# EAGLE design DL40 (EAGLE 6.2)
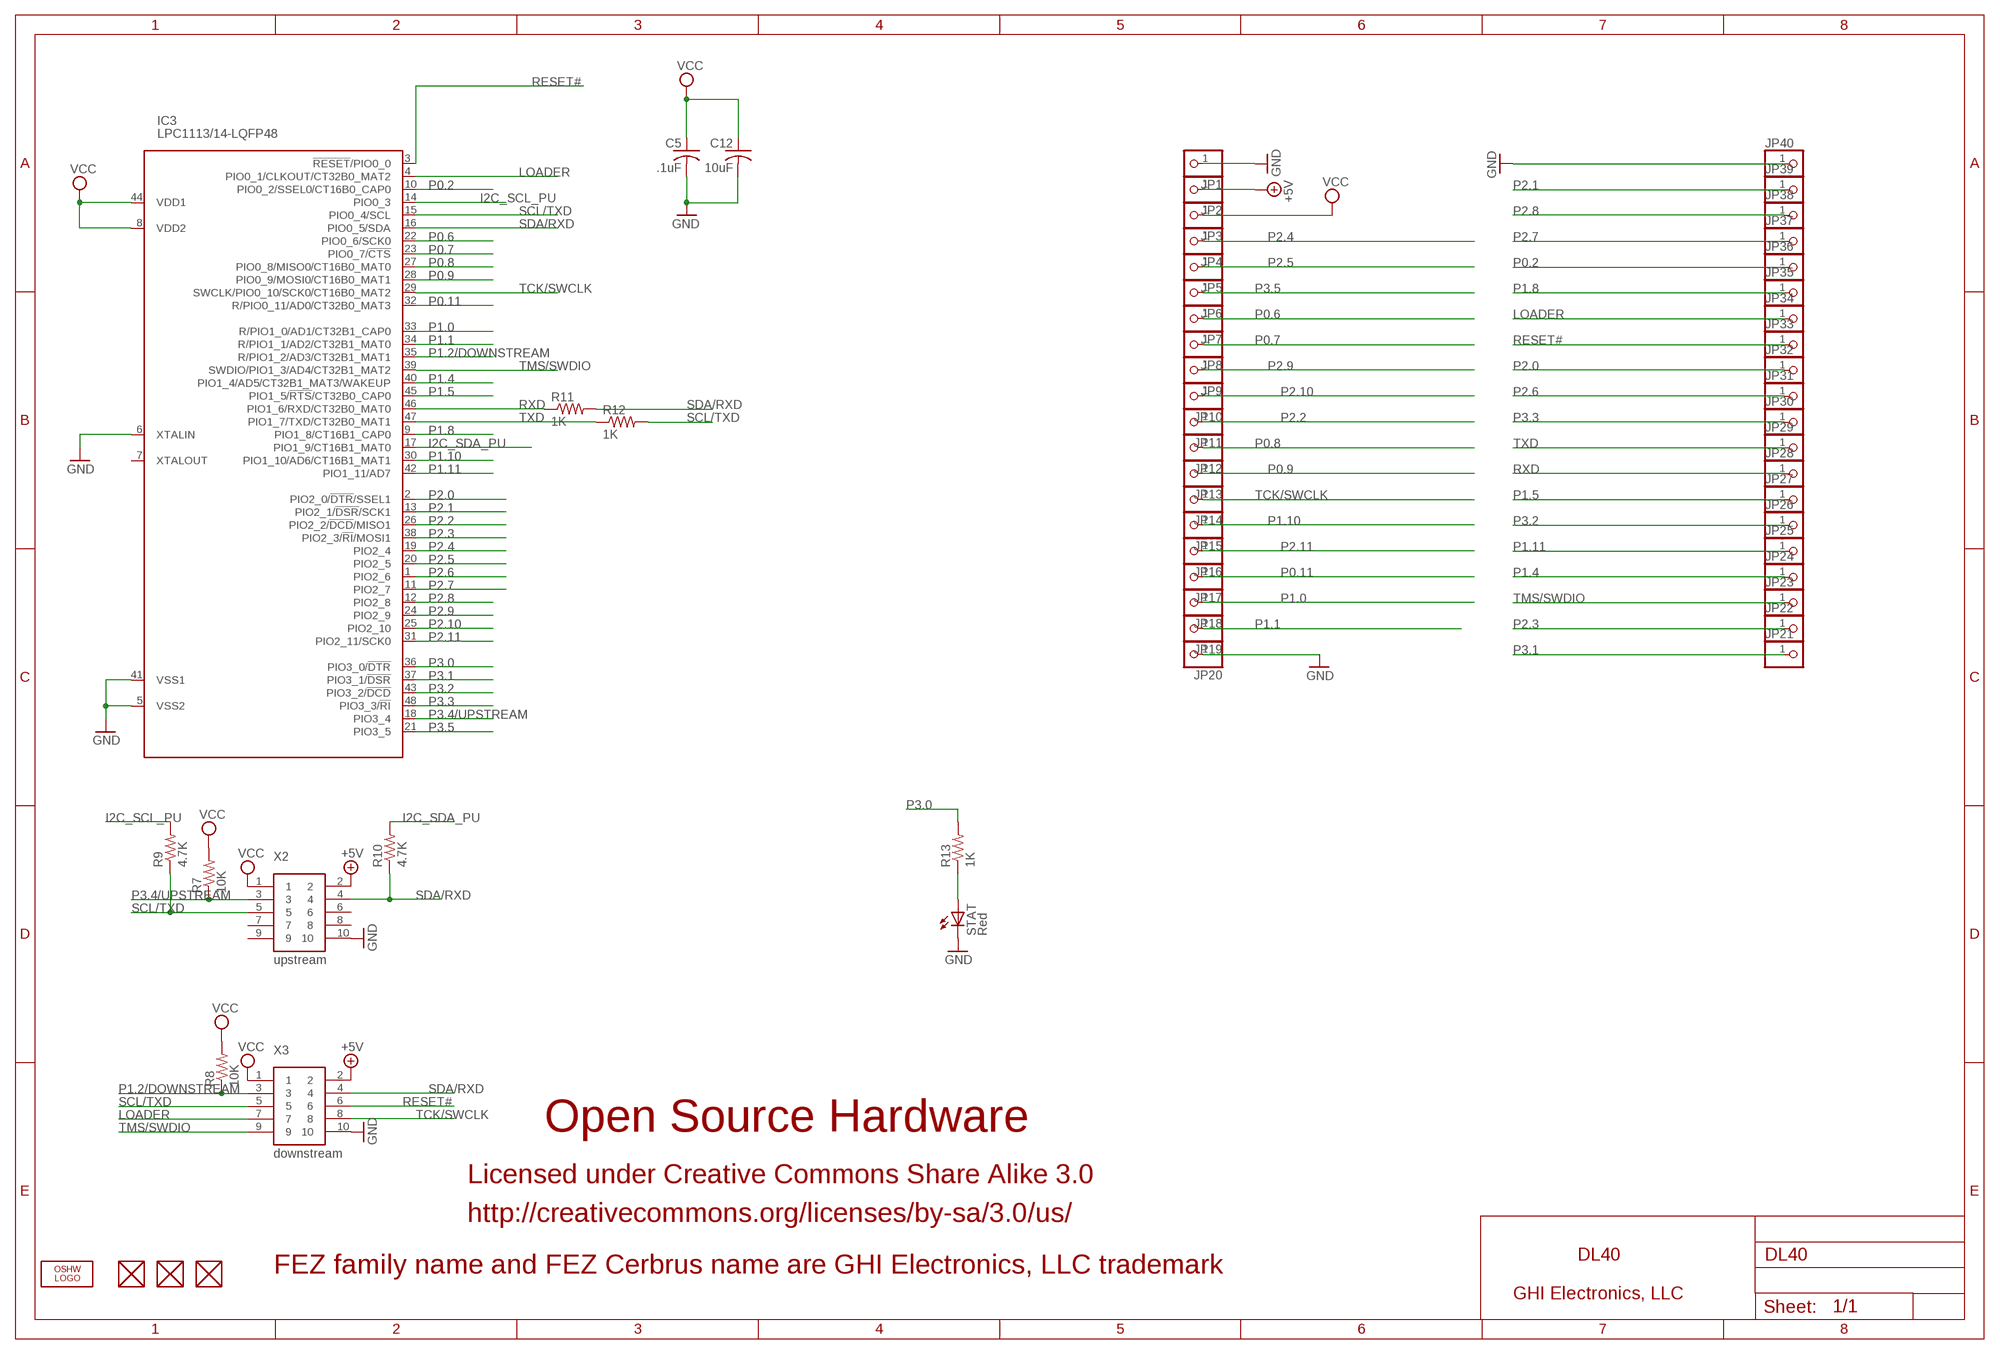
[diagram p0: schematic, sheet 1]

## Parts
C5  .1uF  C-USC0603K  [C0603K]
C12  10uF  C-USC0805K  [C0805K]
FUD4  FIDUCIAL  [FIDUCIAL_40MIL]
FUD5  FIDUCIAL  [FIDUCIAL_40MIL]
FUD6  FIDUCIAL  [FIDUCIAL_40MIL]
IC3  LPC1113/14-LQFP48  [LQFP48]
JP1  PINHD-1X1  [1X01]
JP2  PINHD-1X1  [1X01]
JP3  PINHD-1X1  [1X01]
JP4  PINHD-1X1  [1X01]
JP5  PINHD-1X1  [1X01]
JP6  PINHD-1X1  [1X01]
JP7  PINHD-1X1  [1X01]
JP8  PINHD-1X1  [1X01]
JP9  PINHD-1X1  [1X01]
JP10  PINHD-1X1  [1X01]
JP11  PINHD-1X1  [1X01]
JP12  PINHD-1X1  [1X01]
JP13  PINHD-1X1  [1X01]
JP14  PINHD-1X1  [1X01]
JP15  PINHD-1X1  [1X01]
JP16  PINHD-1X1  [1X01]
JP17  PINHD-1X1  [1X01]
JP18  PINHD-1X1  [1X01]
JP19  PINHD-1X1  [1X01]
JP20  PINHD-1X1  [1X01]
JP21  PINHD-1X1  [1X01]
JP22  PINHD-1X1  [1X01]
JP23  PINHD-1X1  [1X01]
JP24  PINHD-1X1  [1X01]
JP25  PINHD-1X1  [1X01]
JP26  PINHD-1X1  [1X01]
JP27  PINHD-1X1  [1X01]
JP28  PINHD-1X1  [1X01]
JP29  PINHD-1X1  [1X01]
JP30  PINHD-1X1  [1X01]
JP31  PINHD-1X1  [1X01]
JP32  PINHD-1X1  [1X01]
JP33  PINHD-1X1  [1X01]
JP34  PINHD-1X1  [1X01]
JP35  PINHD-1X1  [1X01]
JP36  PINHD-1X1  [1X01]
JP37  PINHD-1X1  [1X01]
JP38  PINHD-1X1  [1X01]
JP39  PINHD-1X1  [1X01]
JP40  PINHD-1X1  [1X01]
LOGO2  LOGO-OSHW-FILLX0200-NT  [OSHW_FILLX200_NOTEXT]
R7  10K  R-US_R0603  [R0603]
R8  10K  R-US_R0603  [R0603]
R9  4.7K  R-US_R0603  [R0603]
R10  4.7K  R-US_R0603  [R0603]
R11  1K  R-US_R0603  [R0603]
R12  1K  R-US_R0603  [R0603]
R13  1K  R-US_R0603  [R0603]
STAT  Red  LEDCHIPLED_0805  [CHIPLED_0805]
X2  upstream  2X5_1.27MM  [2X5_1.27MM]
X3  downstream  2X5_1.27MM  [2X5_1.27MM]

## Nets
+5V: JP2.1 X2.2 X3.2
GND [power]: C5.2 C12.2 IC3.5(VSS2) IC3.6(XTALIN) IC3.41(VSS1) JP1.1 JP20.1 JP40.1 STAT.C X2.10 X3.10
I2C_SCL_PU: IC3.14(PIO0_3) R9.2
I2C_SDA_PU: IC3.17(PIO1_9/CT16B1_MAT0) R10.2
LOADER: IC3.4(PIO0_1/CLKOUT/CT32B0_MAT2) JP34.1 X3.7
N$10: R13.1 STAT.A
P0.2: IC3.10(PIO0_2/SSEL0/CT16B0_CAP0) JP36.1
P0.6: IC3.22(PIO0_6/SCK0) JP7.1
P0.7: IC3.23(PIO0_7/!CTS!) JP8.1
P0.8: IC3.27(PIO0_8/MISO0/CT16B0_MAT0) JP12.1
P0.9: IC3.28(PIO0_9/MOSI0/CT16B0_MAT1) JP13.1
P0.11: IC3.32(R/PIO0_11/AD0/CT32B0_MAT3) JP17.1
P1.0: IC3.33(R/PIO1_0/AD1/CT32B1_CAP0) JP18.1
P1.1: IC3.34(R/PIO1_1/AD2/CT32B1_MAT0) JP19.1
P1.2/DOWNSTREAM: IC3.35(R/PIO1_2/AD3/CT32B1_MAT1) R8.1 X3.3
P1.4: IC3.40(PIO1_4/AD5/CT32B1_MAT3/WAKEUP) JP24.1
P1.5: IC3.45(PIO1_5/!RTS!/CT32B0_CAP0) JP27.1
P1.8: IC3.9(PIO1_8/CT16B1_CAP0) JP35.1
P1.10: IC3.30(PIO1_10/AD6/CT16B1_MAT1) JP15.1
P1.11: IC3.42(PIO1_11/AD7) JP25.1
P2.0: IC3.2(PIO2_0/!DTR!/SSEL1) JP32.1
P2.1: IC3.13(PIO2_1/!DSR!/SCK1) JP39.1
P2.2: IC3.26(PIO2_2/!DCD!/MISO1) JP11.1
P2.3: IC3.38(PIO2_3/!RI!/MOSI1) JP22.1
P2.4: IC3.19(PIO2_4) JP4.1
P2.5: IC3.20(PIO2_5) JP5.1
P2.6: IC3.1(PIO2_6) JP31.1
P2.7: IC3.11(PIO2_7) JP37.1
P2.8: IC3.12(PIO2_8) JP38.1
P2.9: IC3.24(PIO2_9) JP9.1
P2.10: IC3.25(PIO2_10) JP10.1
P2.11: IC3.31(PIO2_11/SCK0) JP16.1
P3.0: IC3.36(PIO3_0/!DTR!) R13.2
P3.1: IC3.37(PIO3_1/!DSR!) JP21.1
P3.2: IC3.43(PIO3_2/!DCD!) JP26.1
P3.3: IC3.48(PIO3_3/!RI!) JP30.1
P3.4/UPSTREAM: IC3.18(PIO3_4) R7.1 X2.3
P3.5: IC3.21(PIO3_5) JP6.1
RESET#: IC3.3(!RESET!/PIO0_0) JP33.1 X3.6
RXD: IC3.46(PIO1_6/RXD/CT32B0_MAT0) JP28.1 R11.1
SCL/TXD: IC3.15(PIO0_4/SCL) R9.1 R12.2 X2.5 X3.5
SDA/RXD: IC3.16(PIO0_5/SDA) R10.1 R11.2 X2.4 X3.4
TCK/SWCLK: IC3.29(SWCLK/PIO0_10/SCK0/CT16B0_MAT2) JP14.1 X3.8
TMS/SWDIO: IC3.39(SWDIO/PIO1_3/AD4/CT32B1_MAT2) JP23.1 X3.9
TXD: IC3.47(PIO1_7/TXD/CT32B0_MAT1) JP29.1 R12.1
VCC [power]: C5.1 C12.1 IC3.8(VDD2) IC3.44(VDD1) JP3.1 R7.2 R8.2 X2.1 X3.1
Unconnected: FUD4.P$1 FUD5.P$1 FUD6.P$1 IC3.7(XTALOUT) X2.6 X2.7 X2.8 X2.9

## Notes on the sheet
- Open Source Hardware
- Licensed under Creative Commons Share Alike 3.0
- http://creativecommons.org/licenses/by-sa/3.0/us/
- DL40
- FEZ family name and FEZ Cerbrus name are GHI Electronics, LLC trademark
- GHI Electronics, LLC

## Library data of the parts
C5 C12 = rcl:C-US: CAPACITOR, American symbol
FUD4-FUD6 = GHI:FIDUCIAL
IC3 = lpc1100v1.1:LPC1113/14-LQFP48: NXP Semiconductors LPC11xx microcontrollers <http://ics.nxp.com/products/lpc1000/lpc11xx/> ARM 32-bit Cortex-M0 Microcontroller with MPU CPU clock up to 50MHz Up to 32KByte on-chip Flash ROM with In-System Programming (ISP) and In-Application Programming (IAP) via On-Chip Bootloader Up to 8KByte SRAM Nested Vectored Interrupt Controller Up to 2 SPI controllers UART with full Modem Interface and RS485 Support Fast Mode I2C-Bus 4 Timers with 4 capture channels and 13 output channels Watchdog (WDT) Sytem tick timer 10-bit ADC with 8 channels Power Management Unit (PMU) Brownout detection 12MHz internal RC oscillator Serial Wire Debug/Trace port
JP1-JP40 = pinhead:PINHD-1X1: PIN HEADER
LOGO2 = Logo:LOGO-OSHW-FILL
R7-R13 = rcl:R-US_: RESISTOR, American symbol
STAT = led:LED: LED OSRAM: - CHIPLED LG R971, LG N971, LY N971, LG Q971, LY Q971, LO R971, LY R971 LH N974, LH R974 LS Q976, LO Q976, LY Q976 LO Q996 - Hyper CHIPLED LW Q18S LB Q993, LB Q99A, LB R99A - SideLED LS A670, LO A670, LY A670, LG A670, LP A670 LB A673, LV A673, LT A673, LW A673 LH A674 LY A675 LS A676, LA A676, LO A676, LY A676, LW A676 LS A679, LY A679, LG A679 - Hyper Micro SIDELED® LS Y876, LA Y876, LO Y876, LY Y876 LT Y87S - SmartLED LW L88C, LW L88S LB L89C, LB L89S, LG L890 LS L89K, LO L89K, LY L89K LS L896, LA L896, LO L896, LY L896 - TOPLED LS T670, LO T670, LY T670, LG T670, LP T670 LSG T670, LSP T670, LSY T670, LOP T670, LYG T670 LG T671, LOG T671, LSG T671 LB T673, LV T673, LT T673, LW T673 LH T674 LS T676, LA T676, LO T676, LY T676, LB T676, LH T676, LSB T676, LW T676 LB T67C, LV T67C, LT T67C, LS T67K, LO T67K, LY T67K, LW E67C LS E67B, LA E67B, LO E67B, LY E67B, LB E67C, LV E67C, LT E67C LW T67C LS T679, LY T679, LG T679 LS T770, LO T770, LY T770, LG T770, LP T770 LB T773, LV T773, LT T773, LW T773 LH T774 LS E675, LA E675, LY E675, LS T675 LS T776, LA T776, LO T776, LY T776, LB T776 LHGB T686 LT T68C, LB T68C - Hyper Mini TOPLED® LB M676 - Mini TOPLED Santana® LG M470 LS M47K, LO M47K, LY M47K Source: http://www.osram.convergy.de LUXEON: - LUMILED® LXK2-PW12-R00, LXK2-PW12-S00, LXK2-PW14-U00, LXK2-PW14-V00 LXK2-PM12-R00, LXK2-PM12-S00, LXK2-PM14-U00 LXK2-PE12-Q00, LXK2-PE12-R00, LXK2-PE12-S00, LXK2-PE14-T00, LXK2-PE14-U00 LXK2-PB12-K00, LXK2-PB12-L00, LXK2-PB12-M00, LXK2-PB14-N00, LXK2-PB14-P00, LXK2-PB14-Q00 LXK2-PR12-L00, LXK2-PR12-M00, LXK2-PR14-Q00, LXK2-PR14-R00 LXK2-PD12-Q00, LXK2-PD12-R00, LXK2-PD12-S00 LXK2-PH12-R00, LXK2-PH12-S00 LXK2-PL12-P00, LXK2-PL12-Q00, LXK2-PL12-R00 Source: www.luxeon.com KINGBRIGHT: KA-3528ASYC Source: www.kingbright.com
X2 X3 = GHI:2X5_1.27MM

## Board
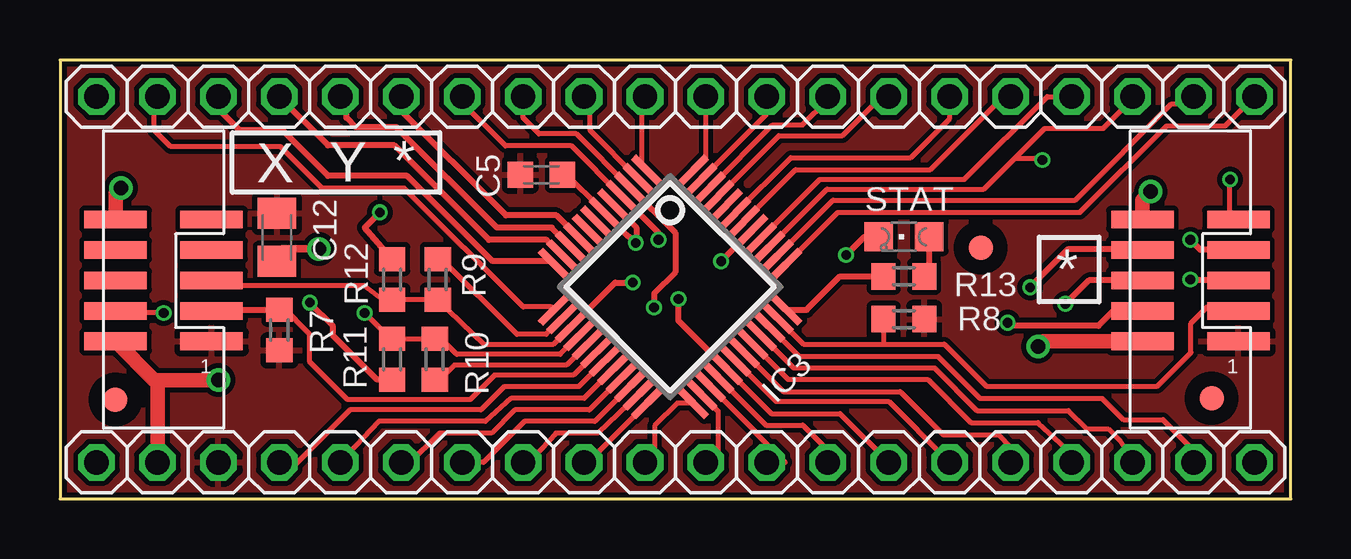
[diagram p1: board, top side]
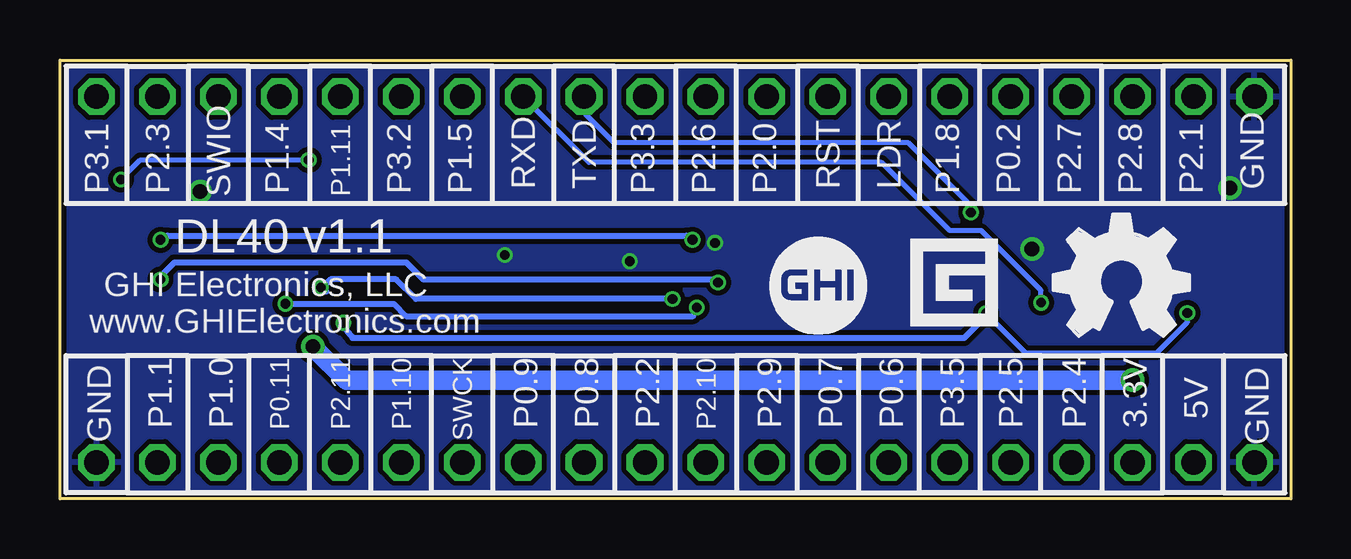
[diagram p2: board, bottom side, seen from below]

Size 51.31 x 18.29 mm. Coordinates in mm from the lower left corner, seen from the top.
Outline: 0,0 51.31,0 51.31,18.29 0,18.29 0,0
Copper layers (1+16): Top 0.035mm / dielectric 1.5mm / Bottom 0.035mm
Design rules: minimum track width 6mil, minimum drill 10mil, track to track 8mil, track to pad 8mil, pad to pad 7.5mil, via to via 8mil, smd to smd 7.5mil, copper to edge 8mil, drill to drill 8mil, minimum pad ring 10mil, minimum via ring 5mil, stop-mask expansion 4mil, vias tented up to drill 50mil, thermal gap 10mil

### Footprints (pad centres in the part's own frame; a part is rotated, then mirrored left to right if it is on the bottom)
C0603K = smd 1.05 x 1.08: 1 -0.875,0; 2 0.875,0
C0805K = smd 1.3 x 1.6: 1 -1,0; 2 1,0
FIDUCIAL_40MIL = smd 1.016 x 1.016: P$1 0,0
LQFP48 = smd 0.3 x 1.6: 1 -2.75,-4.1; 2 -2.25,-4.1; 3 -1.75,-4.1; 4 -1.25,-4.1; 5 -0.75,-4.1; 6 -0.25,-4.1; 7 0.25,-4.1; 8 0.75,-4.1; 9 1.25,-4.1; 10 1.75,-4.1; 11 2.25,-4.1; 12 2.75,-4.1; 25 2.75,4.1; 26 2.25,4.1; 27 1.75,4.1; 28 1.25,4.1; 29 0.75,4.1; 30 0.25,4.1; 31 -0.25,4.1; 32 -0.75,4.1; 33 -1.25,4.1; 34 -1.75,4.1; 35 -2.25,4.1; 36 -2.75,4.1 | smd 1.6 x 0.3: 13 4.1,-2.75; 14 4.1,-2.25; 15 4.1,-1.75; 16 4.1,-1.25; 17 4.1,-0.75; 18 4.1,-0.25; 19 4.1,0.25; 20 4.1,0.75; 21 4.1,1.25; 22 4.1,1.75; 23 4.1,2.25; 24 4.1,2.75; 37 -4.1,2.75; 38 -4.1,2.25; 39 -4.1,1.75; 40 -4.1,1.25; 41 -4.1,0.75; 42 -4.1,0.25; 43 -4.1,-0.25; 44 -4.1,-0.75; 45 -4.1,-1.25; 46 -4.1,-1.75; 47 -4.1,-2.25; 48 -4.1,-2.75
1X01 = drill 1.016 octagon: 1 0,0
R0603 = smd 1 x 1.1: 1 -0.85,0; 2 0.85,0
CHIPLED_0805 = smd 1.2 x 1.2: A 0,-1.05; C 0,1.05
2X5_1.27MM = smd 2.6 x 0.74: 1 -2,2.58; 2 2,2.58; 3 -2,1.31; 4 2,1.31; 5 -2,0.04; 6 2,0.04; 7 -2,-1.23; 8 2,-1.23; 9 -2,-2.5; 10 2,-2.5

### Placement (x,y rotation side)
C5  20.07,13.51 0 top
C12  9.04,10.9 270 top
FUD4  48.01,4.19 0 top
FUD5  38.38,10.46 0 top
FUD6  2.31,4.14 0 top
IC3  25.43,8.84 225 top
JP1  1.52,1.52 0 top
JP2  4.06,1.52 90 top
JP3  6.6,1.52 90 top
JP4  9.14,1.52 90 top
JP5  11.68,1.52 90 top
JP6  14.22,1.52 90 top
JP7  16.76,1.52 90 top
JP8  19.3,1.52 90 top
JP9  21.84,1.52 90 top
JP10  24.38,1.52 90 top
JP11  26.92,1.52 90 top
JP12  29.46,1.52 90 top
JP13  32,1.52 90 top
JP14  34.54,1.52 90 top
JP15  37.08,1.52 90 top
JP16  39.62,1.52 90 top
JP17  42.16,1.52 90 top
JP18  44.7,1.52 90 top
JP19  47.24,1.52 90 top
JP20  49.78,1.52 90 top
JP21  49.78,16.76 0 top
JP22  47.24,16.76 0 top
JP23  44.7,16.76 0 top
JP24  42.16,16.76 0 top
JP25  39.62,16.76 0 top
JP26  37.08,16.76 0 top
JP27  34.54,16.76 0 top
JP28  32,16.76 0 top
JP29  29.46,16.76 0 top
JP30  26.92,16.76 0 top
JP31  24.38,16.76 0 top
JP32  21.84,16.76 0 top
JP33  19.3,16.76 0 top
JP34  16.76,16.76 0 top
JP35  14.22,16.76 0 top
JP36  11.68,16.76 0 top
JP37  9.14,16.76 0 top
JP38  6.6,16.76 0 top
JP39  4.06,16.76 0 top
JP40  1.52,16.76 0 top
LOGO2  9.91,6.78 0 bottom
R7  9.14,7.04 270 top
R8  35.18,7.49 0 top
R9  15.75,9.14 90 top
R10  15.62,5.82 270 top
R11  13.84,5.82 90 top
R12  13.84,9.14 270 top
R13  35.18,9.27 180 top
STAT  35.18,10.92 90 top
X2  4.32,9.14 180 top
X3  47.12,9.14 180 top

### Tracks (layer width: path | path; a pad name or v marks a point on that pad's centre or on a via)
+5V  (via drill 0.61)
  Top 0.61: X3.2 40.98,6.56 v40.77,6.35 | v6.6,4.95 4.06,4.95 | 4.06,4.95 3.93,4.95 X2.2 | JP2.1 4.06,4.95
  Bottom 0.813: v6.6,4.95 39.37,4.95 v40.77,6.35
GND  (via drill 0.41, 0.61)
  Top 0.203: IC3.6 20.94,13.68 C5.2
  Top 0.254: IC3.5 24.03,11.3 v24,10.67 23.62,11 IC3.6 | IC3.41 v27.56,9.91 | STAT.C 33.53,10.92 v32.77,10.16
  Top 0.305: C12.2 9.26,10.41 v10.79,10.41
  Top 0.61: X2.10 2.32,12.73 v2.54,12.95 | X3.10 45.12,12.45 v45.47,12.8
  pour Bottom: -0.64,18.67 -0.64,-0.25 51.44,-0.25 51.44,18.67
I2C_SCL_PU
  Top 0.203: IC3.14 20.27,6.86 19.05,6.86 15.91,9.99 R9.2
I2C_SDA_PU
  Top 0.203: IC3.17 21.11,5.58 16.45,5.58 15.75,4.88 R10.2
LOADER  (via drill 0.41)
  Top 0.203: IC3.4 21.33,14.71 18.57,14.71 16.76,16.51 JP34.1
  Top 0.254: X3.7 47.54,10.37 v47.12,10.79 | IC3.4 24.94,11.09 v24.94,10.79
  Bottom 0.254: v47.12,10.79 47.02,10.79 46.84,10.97 25.2,10.97 24.89,10.67 v24.94,10.79
N$10
  Top 0.254: STAT.A 36.23,9.47 R13.1
P0.2
  Top 0.203: JP36.1 11.94,16.76
  Top 0.254: IC3.10 20.49,11.3 18.21,11.3 14.02,15.49 12.32,15.49 11.94,15.88 11.94,16.76
P0.6
  Top 0.203: IC3.22 22.29,3.23 19.36,3.23 17.65,1.52 JP7.1
P0.7
  Top 0.203: IC3.23 22.42,2.74 20.68,2.74 19.43,1.4 19.3,1.4 JP8.1
P0.8
  Top 0.203: IC3.27 29,2.79 28.96,2.79 30.23,1.52 29.48,1.42 | 29.48,1.42 29.34,1.4 | JP12.1 29.46,1.43 29.48,1.42
P0.9
  Top 0.203: IC3.28 29.43,3.07 30.96,3.07 32.26,1.78 32,1.65 JP13.1
P0.11
  Top 0.203: IC3.32 30.35,4.98 36.17,4.98 37.97,3.17 40.77,3.17 42.16,1.91 JP17.1
P1.0
  Top 0.203: IC3.33 30.57,5.46 36.45,5.46 38.23,3.68 42.04,3.68 42.8,2.92 43.69,2.92 44.2,2.41 44.7,1.65 JP18.1
P1.1
  Top 0.203: IC3.34 30.8,5.94 36.6,5.94 38.35,4.19 43.43,4.19 44.32,3.3 45.97,3.3 47.37,1.91 47.5,1.27 JP19.1
P1.2/DOWNSTREAM
  Top 0.203: IC3.35 31,6.45 34.31,6.45 | 34.31,6.45 36.85,6.45 38.61,4.7 45.74,4.7 47.14,6.1 47.14,7.32 47.85,8.03 48.92,8.03 X3.3 | R8.1 34.33,6.44 34.31,6.45
P1.4
  Top 0.203: IC3.40 31.67,13.31 37.69,13.31 41.15,16.76 JP24.1
P1.5
  Top 0.203: IC3.45 29.96,15.14 32.61,15.14 34.24,16.76 JP27.1
P1.8
  Top 0.254: IC3.9 20.69,11.81 18.59,11.81 14.02,16.38 JP35.1
P1.10
  Top 0.203: IC3.30 29.85,4.06 34.54,4.06 36.96,1.65 37.08,1.65 JP15.1
P1.11
  Top 0.203: IC3.42 30.66,13.72 36.27,13.72 39.32,16.76 JP25.1
P2.0
  Top 0.203: IC3.2 22.1,15.35 22.1,16.76 JP32.1
P2.1
  Top 0.203: IC3.13 20.47,8 19.3,8 14.35,12.95 10.92,12.95 9.2,14.68 4.62,14.68 3.94,15.37 3.94,16.66 | 3.94,16.66 3.94,16.76 | JP39.1 4.04,16.76 3.94,16.66
P2.2
  Top 0.203: IC3.26 27.43,3.65 27.43,2.03 JP11.1
P2.3
  Top 0.203: IC3.38 32.22,12.45 42.32,12.45 46.33,16.46 46.94,16.46 JP22.1
P2.4
  Top 0.203: IC3.19 21.62,4.67 18.52,4.67 17.55,3.71 12.09,3.71 9.78,1.4 9.25,1.4 | 9.25,1.4 9.02,1.4 | JP4.1 9.14,1.5 9.25,1.4
P2.5
  Top 0.203: IC3.20 21.84,4.19 18.8,4.19 17.73,3.23 13.28,3.23 JP5.1 11.56,1.52
P2.6
  Top 0.203: IC3.1 24.26,13.9 24.26,16.66 | 24.26,16.66 24.26,16.89 | JP31.1 24.36,16.76 24.26,16.66
P2.7
  Top 0.254: IC3.11 20.29,10.79 17.88,10.79 13.95,14.73 11.18,14.73 JP37.1
P2.8
  Top 0.203: JP38.1 6.35,16.76
  Top 0.254: IC3.12 20.47,9.91 18.03,9.91 14.48,13.46 11.18,13.46 9.27,15.37 7.49,15.37 6.35,16.51 6.35,16.76
P2.9
  Top 0.203: IC3.24 22.01,1.52 | 22.01,1.52 21.88,1.4 21.84,1.4 | JP9.1 22.01,1.52
P2.10
  Top 0.203: IC3.25 25.74,3.99 24.79,3.05 24.79,1.93 JP10.1
P2.11
  Top 0.203: IC3.31 30.15,4.47 35.03,4.47 36.83,2.67 39.12,2.67 39.62,2.16 39.54,1.67 | 39.54,1.67 39.5,1.4 | JP16.1 39.62,1.59 39.54,1.67
P3.0
  Top 0.203: R13.2 34.29,9.27
  Top 0.254: IC3.36 30.28,7.87 31.11,7.87 32.51,9.27 34.29,9.27
P3.1
  Top 0.203: IC3.37 32.42,11.94 42.52,11.94 46.13,15.54 48.56,15.54 JP21.1
P3.2
  Top 0.203: IC3.43 30.46,14.22 35.46,14.22 37.08,15.85 JP26.1
P3.3
  Top 0.203: IC3.48 26.92,14.22 JP30.1
P3.4/UPSTREAM
  Top 0.203: IC3.18 21.4,5.16 18.11,5.16 17.09,4.14 11.99,4.14 10.41,5.71 10.41,6.86 9.27,8 9.23,8 | 9.23,8 9.02,8 | 9.23,8 R7.1
  Top 0.254: X2.3 6.47,7.89 R7.1
P3.5
  Top 0.203: IC3.21 22.07,3.71 18.95,3.71 17.98,2.74 15.82,2.74 14.48,1.4 14.35,1.4 JP6.1
RESET#  (via drill 0.41)
  Top 0.203: IC3.3 21.53,15.21 19.96,15.21 19.3,15.88 JP33.1
  Top 0.254: X3.6 42.89,9.1 v41.91,8.13 | IC3.3 25.65,11.09 25.65,9.45 24.77,8.56 v24.77,7.98
  Bottom 0.254: v41.91,8.13 37.39,8.13 36.88,7.62 24.92,7.62 v24.77,7.98
RXD  (via drill 0.41)
  Top 0.203: IC3.46 29.7,15.58 30.95,15.58 32,16.64 JP28.1
  Top 0.254: R11.1 13.22,4.97 11.38,6.81 11.38,7.21 v10.41,8.18
  Bottom 0.203: 31.9,16.76 JP28.1 29.26,14.02 17.07,14.02 14.22,11.18 12.9,11.18 10.41,8.69 v10.41,8.18
SCL/TXD  (via drill 0.41)
  Top 0.203: X2.5 6.5,9.04 6.64,8.9 12.66,8.9 13.51,8.26 14.08,8.26 R12.2 R9.1 15.71,8.29 17.68,6.43 20.55,6.43 IC3.15
  Top 0.254: X3.5 47.16,9.1 v47.12,9.14 | IC3.15 23.14,9.02 v23.88,9.02
  Bottom 0.254: v47.12,9.14 47.24,9.14 46.53,9.86 36.88,9.86 36.17,9.14 24,9.14 v23.88,9.02
SDA/RXD  (via drill 0.41)
  Top 0.203: v12.7,7.75 13.88,6.57 R11.2 R10.1 15.99,6.57 16.54,6.02 20.84,6.02 IC3.16 | v4.32,7.75 2.4,7.75 X2.4
  Top 0.254: X3.4 43.9,7.83 43.28,7.21 39.52,7.21 39.61,7.33 v39.5,7.34
  Bottom 0.203: v12.7,7.75 12.6,7.62 11.07,6.1 5.59,6.1 4.32,7.37 v4.32,7.75
  Bottom 0.254: v39.5,7.34 39.6,7.29 39.12,6.71 13.61,6.71 12.8,7.52 v12.7,7.75
TCK/SWCLK  (via drill 0.41)
  Top 0.203: IC3.29 29.65,3.56 32.51,3.56 JP14.1 34.67,1.52
  Top 0.254: IC3.29 25.78,7.43 v25.78,8.33 | v40.44,8.81 42.04,10.41 45.08,10.41 X3.8
  Bottom 0.254: v25.78,8.33 36.47,8.33 37.29,9.14 40.03,9.14 40.44,8.74 40.21,8.64 v40.44,8.81
TMS/SWDIO  (via drill 0.41)
  Top 0.203: IC3.39 31.97,12.9 38.51,12.9 39.78,14.17 | 39.78,14.17 41.05,15.44 43.48,15.44 44.7,16.66 JP23.1 | X3.9 48.77,11.99 v48.77,13.31 | v40.95,14.12 40.89,14.17 39.78,14.17
  Bottom 0.203: v48.77,13.31 47.95,14.12 v40.95,14.12
TXD  (via drill 0.41)
  Top 0.203: IC3.47 29.46,16.05 JP29.1
  Top 0.254: R12.1 12.7,11.3 v13.34,11.94
  Bottom 0.203: v13.34,11.94 13.34,12.22 15.95,14.83 28.22,14.83 29.39,16 29.46,16.13 JP29.1
VCC
  pour Top: 51.56,-0.25 51.56,18.54 -0.13,18.54 -0.13,-0.25

### Text on the board
tPlace: X | Y | * | *
bPlace: GND | P2.1 | P2.8 | P2.7 | P0.2 | P1.8 | LDR | RST | P2.0 | P2.6 | P3.3 | TXD | RXD | P1.5 | P3.2 | P1.11 | P1.4 | SWIO | P2.3 | P3.1 | DL40 v1.1 | GHI Electronics, LLC | www.GHIElectronics.com | 3.3V | P2.4 | P2.5 | P3.5 | P0.6 | P0.7 | P2.9 | P2.10 | P2.2 | P0.8 | P0.9 | SWCK | P1.10 | P2.11 | P0.11 | P1.0 | P1.1 | GND | GND | 5V